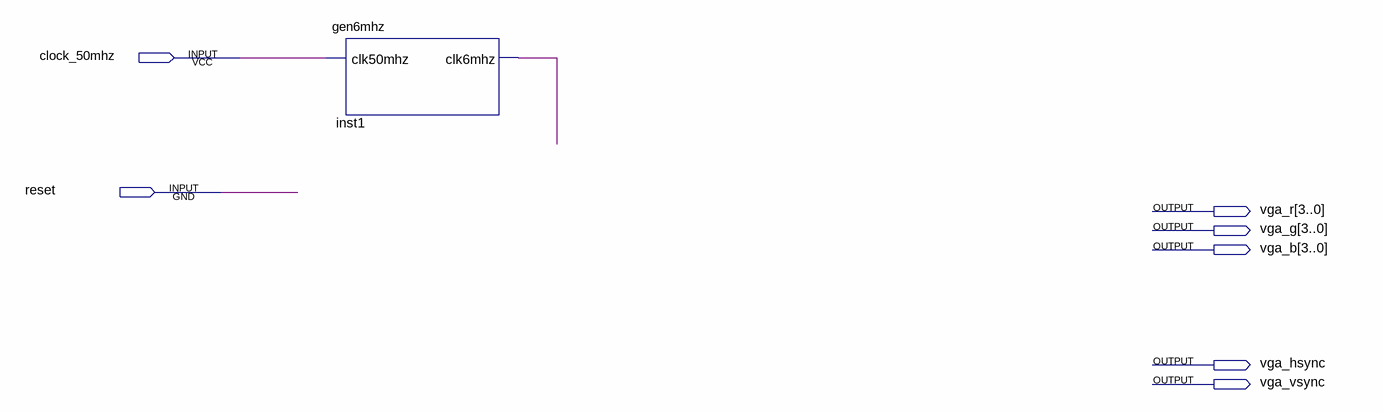
[diagram p0: schematic sheet]
// Quartus schematic top_de1.bdf as structural Verilog: 1 symbols, 7 pins
module top_de1 (
  input  clock_50mhz,
  input  reset,
  output [3:0] vga_r,
  output [3:0] vga_g,
  output [3:0] vga_b,
  output vga_hsync,
  output vga_vsync
);

  wire inst1_clk6mhz;

  gen6mhz inst1 (.clk50mhz(clock_50mhz), .clk6mhz(inst1_clk6mhz));
endmodule
